# Altium schematic sheet FPGA_PD.SchDoc
size A4; SheetNumber: 5; SheetTotal: 9
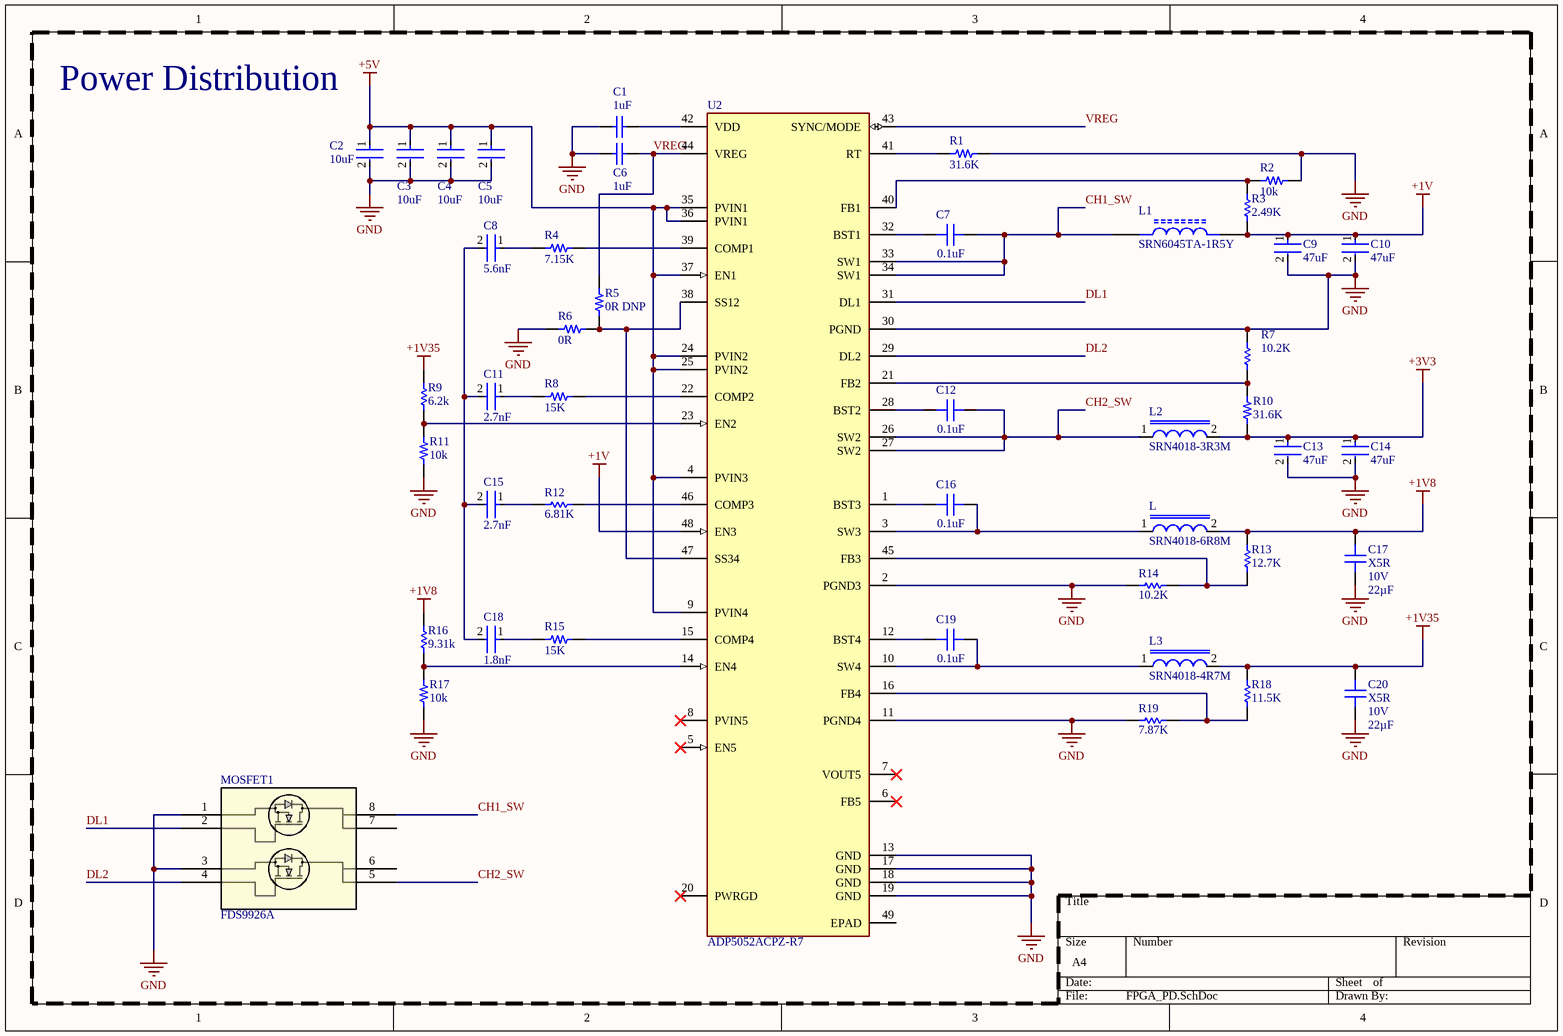
[diagram p0: FPGA_PD.SchDoc]

## Parts
C1  1uF  [CAPC1005X55X25LL05T10]
C2  10uF  [FP-GRM155-0_2-IPC_A]
C3  10uF  [FP-GRM155-0_2-IPC_A]
C4  10uF  [FP-GRM155-0_2-IPC_A]
C5  10uF  [FP-GRM155-0_2-IPC_A]
C6  1uF  [CAPC1005X55X25LL05T10]
C7  Capacitance: 0.1uF  [CAP 0603_1608]  (hidden comment: CAP CER 0.1UF 100V 10% X7R 0603)
C8  5.6nF  [FP-GRM188-0_1-e0_2_0_5-IPC_A]
C9  47uF  [FP-GRM21B-0_2-MFG]
C10  47uF  [FP-GRM21B-0_2-MFG]
C11  2.7nF  [FP-GRM188-0_1-e0_2_0_5-MFG]
C12  Capacitance: 0.1uF  [CAP 0603_1608]  (hidden comment: CAP CER 0.1UF 100V 10% X7R 0603)
C13  47uF  [FP-GRM21B-0_2-MFG]
C14  47uF  [FP-GRM21B-0_2-MFG]
C15  2.7nF  [FP-GRM188-0_1-e0_2_0_5-MFG]
C16  Capacitance: 0.1uF  [CAP 0603_1608]  (hidden comment: CAP CER 0.1UF 100V 10% X7R 0603)
C17  Dielectric Code: X5R  Voltage Rating: 10V  Capacitance: 22µF  [CAP 0603_1608]  (hidden comment: CAP CER 22UF 10V 20% X5R 0603)
C18  1.8nF  [FP-GRM188-0_1-e0_2_0_5-IPC_B]
C19  Capacitance: 0.1uF  [CAP 0603_1608]  (hidden comment: CAP CER 0.1UF 100V 10% X7R 0603)
C20  Dielectric Code: X5R  Voltage Rating: 10V  Capacitance: 22µF  [CAP 0603_1608]  (hidden comment: CAP CER 22UF 10V 20% X5R 0603)
L  SRN4018-6R8M  [INDP4040X180N - duplicate]
L1  SRN6045TA-1R5Y  [IND_SRN6045TA-1R5Y]
L2  SRN4018-3R3M  [INDP4040X180N - duplicate]
L3  SRN4018-4R7M  [FP-SRN4018-MFG]
MOSFET1  FDS9926A  [SOIC8_751EB_ONS-M]
R1  31.6K  [RES 0603_1608]
R2  10k  [RES 0603_1608]
R3  2.49K  [RESC1608X55X30ML20T20]
R4  7.15K  [FP-AC0603-IPC_A]
R5  0R DNP  [RES 0603_1608]
R6  0R  [RES 0603_1608]
R7  10.2K  [RESC1608X55X25LL10T15]
R8  15K  [RES 0603_1608]
R9  6.2k  [RESC1608X55X25ML10T15]
R10  31.6K  [RES 0603_1608]
R11  10k  [RES 0603_1608]
R12  6.81K  [RESC1608X55X25ML10T15]
R13  12.7K  [RESC1608X55X30LL15T15]
R14  10.2K  [RESC1608X55X25LL10T15]
R15  15K  [RES 0603_1608]
R16  9.31k  [RESC1608X55X25LL10T15]
R17  10k  [RES 0603_1608]
R18  11.5K  [RESC1608X55X25LL10T15]
R19  7.87K  [RESC1608X55X25NL10T15]
U2  ADP5052ACPZ-R7  [FP-CP-48-13-IPC_A]

## Nets
+1V: C9.1 C10.1 L1.2 R3.1 U2.48(EN3)
+1V8: C17.1 L.2 R13.2 R16.1
+1V35: C20.1 L3.2 R9.1 R18.1
+3V3: C13.1 C14.1 L2.2 R10.2
+5V: C2.1 C3.1 C4.1 C5.1 U2.4(PVIN3) U2.9(PVIN4) U2.24(PVIN2) U2.25(PVIN2) U2.35(PVIN1) U2.36(PVIN1) U2.37(EN1)
GND: C1.1 C2.2 C3.2 C4.2 C5.2 C6.1 C9.2 C10.2 C13.2 C14.2 C17.2 C20.2 MOSFET1.1 MOSFET1.3 R1.2 R2.1 R6.1 R7.1 R11.2 R14.2 R17.2 R19.1 U2.2(PGND3) U2.11(PGND4) U2.13(GND) U2.17(GND) U2.18(GND) U2.19(GND) U2.30(PGND)
CH1_SW: C7.1 L1.1 MOSFET1.8 U2.33(SW1) U2.34(SW1)
CH2_SW: C12.1 L2.1 MOSFET1.5 U2.26(SW2) U2.27(SW2)
DL1: MOSFET1.2 U2.31(DL1)
DL2: MOSFET1.4 U2.29(DL2)
VREG: C6.2 R5.2 U2.43(SYNC/MODE) U2.44(VREG)
NetC1_2: C1.2 U2.42(VDD)
NetC7_2: C7.2 U2.32(BST1)
NetC8_1: C8.1 R4.1
NetC8_2: C8.2 C11.2 C15.2 C18.2
NetC11_1: C11.1 R8.1
NetC12_2: C12.2 U2.28(BST2)
NetC15_1: C15.1 R12.1
NetC16_1: C16.1 L.1 U2.3(SW3)
NetC16_2: C16.2 U2.1(BST3)
NetC18_1: C18.1 R15.1
NetC19_1: C19.1 L3.1 U2.10(SW4)
NetC19_2: C19.2 U2.12(BST4)
NetR1_1: R1.1 U2.41(RT)
NetR2_2: R2.2 R3.2 U2.40(FB1)
NetR4_2: R4.2 U2.39(COMP1)
NetR5_1: R5.1 R6.2 U2.38(SS12) U2.47(SS34)
NetR7_2: R7.2 R10.1 U2.21(FB2)
NetR8_2: R8.2 U2.22(COMP2)
NetR9_2: R9.2 R11.1 U2.23(EN2)
NetR12_2: R12.2 U2.46(COMP3)
NetR13_1: R13.1 R14.1 U2.45(FB3)
NetR15_2: R15.2 U2.15(COMP4)
NetR16_2: R16.2 R17.1 U2.14(EN4)
NetR18_2: R18.2 R19.2 U2.16(FB4)

Not connected (* = marked no-connect by the designer): MOSFET1 6 7; U2 5(EN5)* 6(FB5)* 7(VOUT5)* 8(PVIN5)* 20(PWRGD)* 49(EPAD)

## Notes on the sheet
- Power Distribution

## Library data of the parts
C1 C6 = CMP-2008-03928-1: Manufacturer: Murata; Part Number: GRM155R71C104KA88J
C2-C5 = CMP-06035-026070-1: Chip Multilayer Ceramic Capacitors for General Purpose, 0402, 10uF, X5R, 15%, 20%, 10V
C7 C12 C16 C19 = CMP-013-0022-14: Ceramic Capacitor, Multilayer, Ceramic, 100V, 10% +Tol, 10% -Tol, X7R, 15% TC, 0.1uF, Surface Mount, 0603; Case/Package: 0603; Tolerance: 10%
C8 = CMP-06035-024846-1: Chip Multilayer Ceramic Capacitors for General Purpose, 0603, 5600pF, C0G, 30ppm/°C, 5%, 50V; Width: 0.031inch; Case Code (Metric): 1608; Voltage Rating (DC): 50V; Length: 1.6mm; Termination: SMD/SMT; Packaging: Tape and Reel; Lead Pitch: 0.5mm; Package Quantity: 4000; Max Operating Temperature: 125°C; Thickness: 0.035inch; Tolerance: 5%; Dielectric: C0G; Depth: 0.8mm; Mount: Surface Mount; Min Operating Temperature: -55°C; Case Code (Imperial): 0603; Case/Package: 0603; Lead Free: Lead Free; Height: 0.8mm; Capacitance: 5.6nF; Voltage Rating: 50V
C9 C10 C13 C14 = CMP-2007-03221-2: CAP CER 47UF 6.3V X5R 0805; Tolerance: 20%; Min Operating Temperature: -55°C; Depth: 1.25mm; Thickness: 0.057inch; RoHS Compliant: Yes; Dielectric: X5R; Voltage Rating: 6.3V; Case/Package: 0805; Height: 1.25mm; Package Quantity: 3000; Case Code (Metric): 2012; Termination: SMD/SMT; Packaging: Tape and Reel; Voltage Rating (DC): 6.3V; Weight: 0.000335oz; Width: 0.049inch; Capacitance: 47uF; Length: 2mm; Lead Free: Lead Free; Max Operating Temperature: 85°C; Voltage: 6.3V; REACH SVHC: No SVHC; Mount: Surface Mount; Case Code (Imperial): 0805
C11 C15 = CMP-2006-02644-2: Chip Multilayer Ceramic Capacitors for General Purpose, 0603, 2700pF, C0G, 30ppm/°C, 5%, 50V; Thickness: 0.035inch; Height: 0.8mm; Case Code (Metric): 1608; Max Operating Temperature: 125°C; Voltage Rating (DC): 50V; Voltage: 50V; Package Quantity: 1; Radiation Hardening: No; Termination: SMD/SMT; Depth: 0.8mm; Packaging: Tape and Reel; Dielectric: C0G; REACH SVHC: No SVHC; Lead Free: Lead Free; Case Code (Imperial): 0603; Temperature Coefficient: 30ppm/°C; Min Operating Temperature: -55°C; Mount: Surface Mount; Case/Package: 0603; Capacitance: 2.7nF; Voltage Rating: 50V; Tolerance: 5%; Length: 1.6mm; Width: 0.031inch
C17 C20 = CMP-013-0021-7: Ceramic Capacitor, Multilayer, Ceramic, 10V, 20% +Tol, 20% -Tol, X5R, 15% TC, 22uF, Surface Mount, 0603; Case/Package: 0603; Tolerance: 20%
C18 = CMP-2006-02620-2: Chip Multilayer Ceramic Capacitors for General Purpose, 0603, 1800pF, C0G, 30ppm/°C, 5%, 50V; Thickness: 0.035inch; Case Code (Metric): 1608; Voltage Rating (DC): 50V; Packaging: Tape and Reel; Voltage Rating: 50V; Dielectric: C0G; Voltage: 50V; Length: 1.6mm; Package Quantity: 10000; Termination: SMD/SMT; Min Operating Temperature: -55°C; Max Operating Temperature: 125°C; Height: 0.8mm; Case/Package: 0603; Mount: Surface Mount; Case Code (Imperial): 0603; Radiation Hardening: No; Capacitance: 1.8nF; Depth: 0.8mm; Width: 0.031inch; Tolerance: 5%
L = SRN4018-6R8M: 6.8ÂµH Semi-Shielded Wirewound Inductor 1.5A 118mOhm Max Nonstandard; MF: Bourns; SnapEDA_Link: https://www.snapeda.com/parts/SRN4018-6R8M/Bourns/view-part/447321/?ref=snap; Availability: Unavailable; Value: *; Price: None; MP: SRN4018-6R8M; Package: Nonstandard Bourns
L1 = SRN6045TA-1R5Y: Inductor Power Semi-Shielded Wirewound 220uH 20% 1MHz 15Q-Factor Ferrite 600mA 900mOhm DCR 2424 Automotive T/R; Package: None; Price: None; Value: *; MP: SRN6045TA-1R5Y; Availability: Unavailable
L2 = SRN4018-3R3M: 3.3ÂµH Semi-Shielded Wirewound Inductor 2.2A 66mOhm Max Nonstandard; MF: Bourns; SnapEDA_Link: https://www.snapeda.com/parts/SRN4018-3R3M/Bourns/view-part/485003/?ref=snap; Mouser-Purchase-URL: https://snapeda.com/shop?store=Mouser&id=485003; Availability: Good; DigiKey-Purchase-URL: https://snapeda.com/shop?store=DigiKey&id=485003; MP: SRN4018-3R3M; Package: Nonstandard Bourns; Value: *; Price: None; Arrow_Electronics-Purchase-URL: https://snapeda.com/shop?store=Arrow+Electronics&id=485003; Arrow_Europe-Purchase-URL: https://snapeda.com/shop?store=Arrow+Europe&id=485003
L3 = CMP-07248-000014-1: FIXED IND 4.7UH 1.9A 84 MOHM SMD; Manufacturer: Bourns; Q Factor: 9; Series Resistance: 0.084Ω; Test Frequency: 7.96MHz; Self Resonant Frequency: 35MHz; Tolerance: 20%; Core Material: Ferrite; Shielding: true; Saturation Current: 2A; Lead Free: Yes; Rms Current: 1.9A; Temperature: -40°C to +125°C; Value: 4.7uH; Inductance: 4.7uH; Device Class L1: Passive Components; Automotive: No; Octopart: https://octopart.com/srn4018-4r7m-bourns-25452396; Mouser Description: Fixed Inductors 4.7uH 20% SMD 4018; Package: SRN4018; Height: 1.8mm; Device Class L3: Fixed Inductors; ComponentLink2Description: Datasheet; Composition: Wirewound; Category: Ind; RoHS: TRUE; Manufacturer Part Number: SRN4018-4R7M; ComponentLink2URL: https://www.bourns.com/docs/Product-Datasheets/SRN4018.pdf; Temperature Range High: +125°C; Temperature Range Low: -40°C; Digikey Description: FIXED IND 4.7UH 1.9A 84 MOHM SMD; Device Class L2: Inductors
MOSFET1 = FDS9926A: No Description Available; Mfr_Name: onsemi; RefDes: RefDes; Type: Type
R1 R10 = CMP-00065-1: Fixed Resistor, Metal Glaze/thick Film, 0.1W, 31600ohm, 75V, 1% +/-Tol, 100ppm/Cel, Surface Mount, 0603; Temperature Coefficient: 100ppm/°C; Case/Package: 0603; Voltage Rating: 75V
R2 R11 R17 = CMP-009-00190-14: 10 ±1% 0.1W, 1/10W Chip Resistor 0603 (1608 Metric) Automotive AEC-Q200 Thick Film; Voltage Rating: 75V; Temperature Coefficient: 100ppm/°C; Case/Package: 0603
R3 = CMP-2000-00003-1: Part Number: ERA3AEB2491V; Manufacturer: Panasonic
R4 = CMP-03412-024834-2: RES 7.15KΩ 1.00% 0.1W 0603; Power Rating: 100mW; Voltage Rating: 50V; Temperature Coefficient: 100ppm/°C; Tolerance: 1%; Resistance: 7.15kR; Max Power Dissipation: 100mW; Resistor Type: Thick Film; Height: 0.022inch; Termination: SMD/SMT; Case/Package: 0603; Max Operating Temperature: 155°C; Width: 0.8mm; Case Code (Imperial): 0603; Min Operating Temperature: -55°C; Case Code (Metric): 1608; RoHS Compliant: Yes; Weight: 7.1E-05oz; Number of Terminations: 2; Length: 0.063inch; Packaging: Tape and Reel; Features: Moisture Resistant; Series: AC
R5 R6 = CMP-010-0000-7: Fixed Resistor, Metal Glaze/thick Film, 0.1W, 0ohm, Surface Mount, 0603; Voltage Rating: 75V; Temperature Coefficient: 0ppm/°C; Case/Package: 0603
R7 R14 = CMP-2000-06926-1: Chip Resistor, 10.2 KOhm, +/- 1%, 0.1 W, -55 to 155 degC, 0603 (1608 Metric), RoHS, Tape and Reel; Brand: Yageo; Power Rating: 100mW; Voltage Rating: 75V; Resistance: 10.2kOhms; Unit Weight: 0.000071oz; Temperature Coefficient: 100PPM/C; Package Reference: 0603; Product: ThickFilmResistorsGeneralPurpose; Series: RC; Tolerance: 1%; Datasheet Version: Rev. 7, 05/2017; Case Code - in: 0603; Packaging: Reel; Manufacturer URL: http://www.yageo.com/; Manufacturer: Yageo; Package / Case: 0603(1608metric); Width: 0.8mm; Operating Temperature Range: -55Cto+155C; Package Description: 2-Pin Surface Mount Device, Body 1.6 x 0.8 mm; RoHS: True; Height: 0.45mm; Termination Style: SMD/SMT; Product Category: ThickFilmResistors; Type: GeneralPurposeChipResistorSurfaceMount; Case Code - mm: 1608; Datasheet URL: http://www.yageo.com/documents/recent/PYu-RC_Group_51_RoHS_L_7.pdf; Length: 1.6mm; Mounting Technology: SurfaceMount
R8 R15 = CMP-010-0035-11: 15 kOhms ±1% 0.1W, 1/10W Chip Resistor 0603 (1608 Metric) Moisture Resistant Thick Film; Temperature Coefficient: 100ppm/°C; Voltage Rating: 75V; Case/Package: 0603
R9 = CMP-2000-04287-1: Part Number: RC0603JR-076K2L; Manufacturer: Yageo
R12 = CMP-2000-04120-1: Part Number: RC0603FR-076K81L; Manufacturer: Yageo
R13 = CMP-2000-00228-1: Manufacturer: Panasonic; Part Number: ERJ-3EKF1272V
R16 = CMP-2000-04169-1: Part Number: RC0603FR-079K31L; Manufacturer: Yageo
R18 = CMP-2000-04891-1: Manufacturer: Yageo; Part Number: RC0603FR-0711K5L
R19 = CMP-2000-04136-1: Part Number: RC0603FR-07787KL; Manufacturer: Yageo
U2 = CMP-00026-22488692-1: ADP5052ACPZ-R7 5-Channel Integrated Power Solution with Quad Buck Regulators and 200 mA LDO Regulator; Manufacturer Lifecycle Status: PRODUCTION; Switching Frequency: 740kHz; Min Input Voltage: 4.5V; Output Type: Adjustable, Fixed; Max Junction Temperature (Tj): 125°C; Nominal Supply Current: 4.8mA; Max Duty Cycle: 50%; Voltage - Output 3: 1.8V; Current - Output 3: 1.2A; Max Input Voltage: 15V; Voltage - Output 2: 5V; Max Output Current: 4kA; Output Voltage: 3.305V; Output Current: 200mA; Max Output Voltage: 13.5V; Voltage - Output 1: 1.6V; Number of Outputs: 5; Min Output Voltage: 800mV; Max Operating Temperature: 125°C; REACH SVHC: No SVHC; Mount: Surface Mount; Lead Free: Contains Lead; NexarPartId: 22488692; Contact Plating: Tin; Number of Pins: 48; Lifecycle Status: Production; Case/Package: LFCSP EP; Min Supply Voltage: 4.5V; Min Operating Temperature: -40°C; RoHS: Compliant; Width: 7.1mm; Packaging: Cut Tape (CT); Height: 730µm; Max Supply Voltage: 15V; Schedule B: 8542390000, 8542390000; Operating Supply Voltage: 15V; Length: 7mm